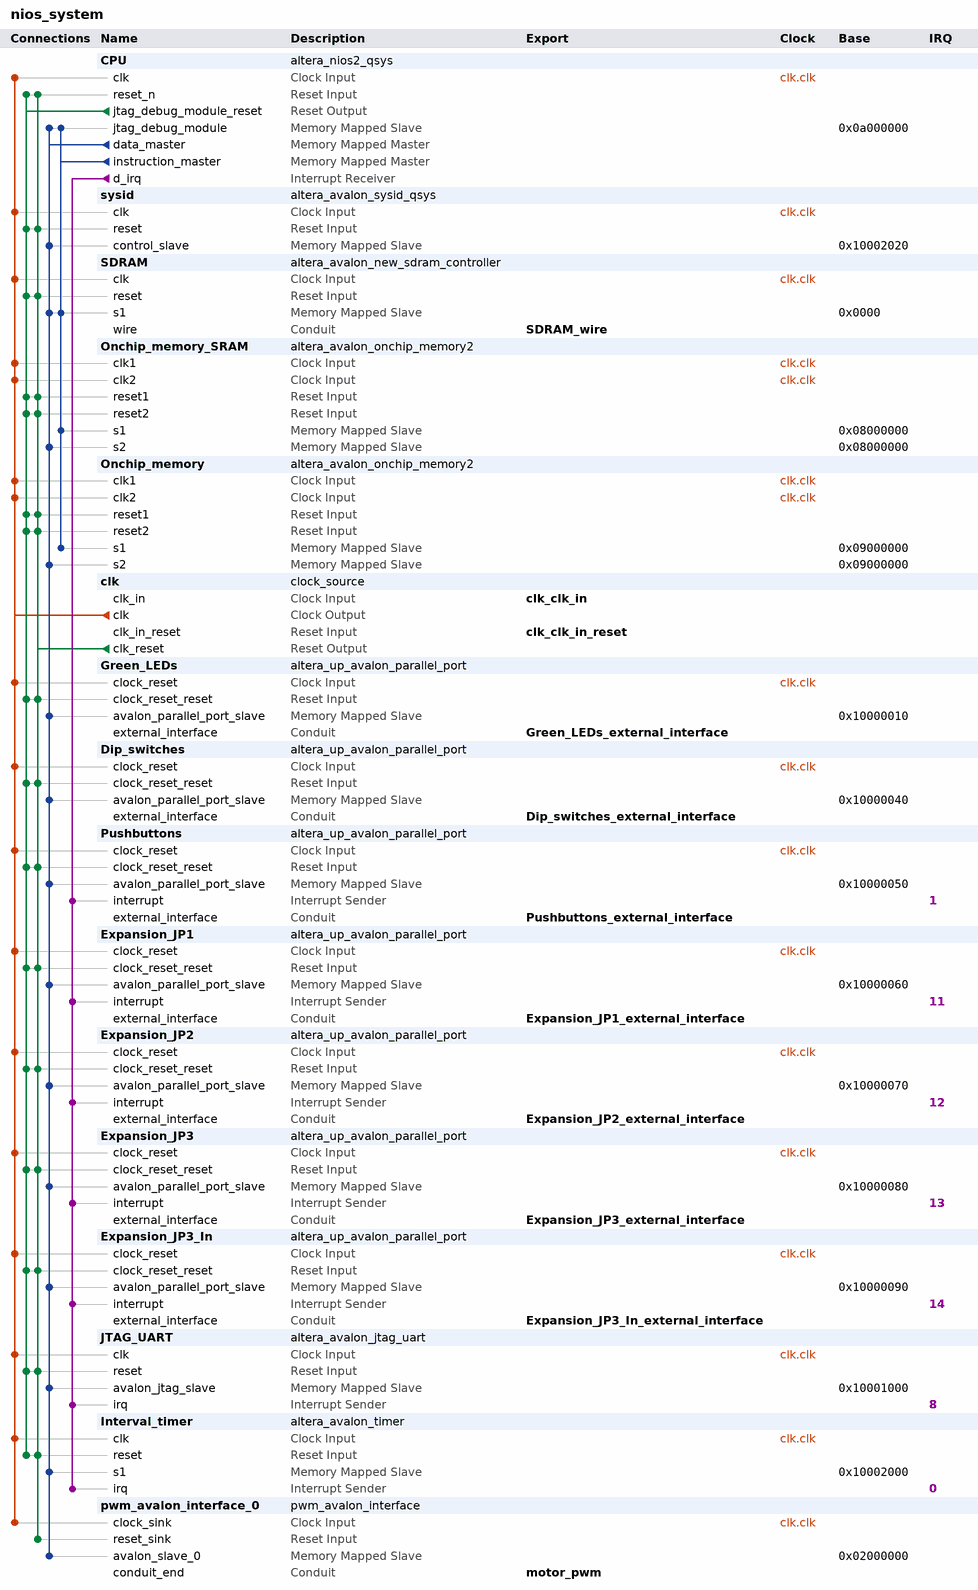
[diagram p0: system contents]
# Platform Designer (Qsys) system nios_system, Cyclone IV E EP4CE22F17C6
# Parameters at their usual value, and those the tool derives, are not listed.
package require -exact qsys 13.0
create_system nios_system
set_project_property DEVICE_FAMILY {Cyclone IV E}
set_project_property DEVICE EP4CE22F17C6

add_instance CPU altera_nios2_qsys 13.0
set_instance_parameter_value CPU manuallyAssignCpuID false
set_instance_parameter_value CPU resetSlave SDRAM.s1
set_instance_parameter_value CPU exceptionSlave SDRAM.s1
set_instance_parameter_value CPU breakSlave CPU.jtag_debug_module
set_instance_parameter_value CPU mmu_processIDNumBits 10
set_instance_parameter_value CPU impl Tiny
set_instance_parameter_value CPU icache_size 4096
set_instance_parameter_value CPU dcache_lineSize 4

add_instance sysid altera_avalon_sysid_qsys 13.0
set_instance_parameter_value sysid id 0

add_instance SDRAM altera_avalon_new_sdram_controller 13.0.1.99.2
set_instance_parameter_value SDRAM TAC 5.5
set_instance_parameter_value SDRAM TRCD 20.0
set_instance_parameter_value SDRAM TRP 20.0
set_instance_parameter_value SDRAM casLatency 3
set_instance_parameter_value SDRAM columnWidth 9
set_instance_parameter_value SDRAM dataWidth 16
set_instance_parameter_value SDRAM generateSimulationModel true
set_instance_parameter_value SDRAM model custom
set_instance_parameter_value SDRAM numberOfBanks 4
set_instance_parameter_value SDRAM numberOfChipSelects 1
set_instance_parameter_value SDRAM powerUpDelay 100.0
set_instance_parameter_value SDRAM refreshPeriod 15.625
set_instance_parameter_value SDRAM rowWidth 13

add_instance Onchip_memory_SRAM altera_avalon_onchip_memory2 13.0.1.99.2
set_instance_parameter_value Onchip_memory_SRAM dataWidth 32
set_instance_parameter_value Onchip_memory_SRAM dualPort true
set_instance_parameter_value Onchip_memory_SRAM initMemContent true
set_instance_parameter_value Onchip_memory_SRAM initializationFileName Onchip_memory_SRAM
set_instance_parameter_value Onchip_memory_SRAM memorySize 8192

add_instance Onchip_memory altera_avalon_onchip_memory2 13.0.1.99.2
set_instance_parameter_value Onchip_memory dataWidth 32
set_instance_parameter_value Onchip_memory dualPort true
set_instance_parameter_value Onchip_memory initMemContent true
set_instance_parameter_value Onchip_memory initializationFileName Onchip_memory
set_instance_parameter_value Onchip_memory memorySize 8192

add_instance clk clock_source 13.0
set_instance_parameter_value clk clockFrequency 50000000

add_instance Green_LEDs altera_up_avalon_parallel_port 13.0
set_instance_parameter_value Green_LEDs board DE0-Nano
set_instance_parameter_value Green_LEDs preset LEDs
set_instance_parameter_value Green_LEDs capture false
set_instance_parameter_value Green_LEDs edge Rising
set_instance_parameter_value Green_LEDs irq false

add_instance Dip_switches altera_up_avalon_parallel_port 13.0
set_instance_parameter_value Dip_switches board DE0-Nano
set_instance_parameter_value Dip_switches preset {Dip Switches}
set_instance_parameter_value Dip_switches capture false
set_instance_parameter_value Dip_switches edge Rising
set_instance_parameter_value Dip_switches irq false

add_instance Pushbuttons altera_up_avalon_parallel_port 13.0
set_instance_parameter_value Pushbuttons board DE0-Nano
set_instance_parameter_value Pushbuttons preset Pushbuttons
set_instance_parameter_value Pushbuttons capture true
set_instance_parameter_value Pushbuttons edge Falling
set_instance_parameter_value Pushbuttons irq true

add_instance Expansion_JP1 altera_up_avalon_parallel_port 13.0
set_instance_parameter_value Expansion_JP1 board DE0-Nano
set_instance_parameter_value Expansion_JP1 preset {Expansion Header}
set_instance_parameter_value Expansion_JP1 capture true
set_instance_parameter_value Expansion_JP1 edge Falling
set_instance_parameter_value Expansion_JP1 irq true

add_instance Expansion_JP2 altera_up_avalon_parallel_port 13.0
set_instance_parameter_value Expansion_JP2 board DE0-Nano
set_instance_parameter_value Expansion_JP2 preset {Expansion Header}
set_instance_parameter_value Expansion_JP2 gpio {GPIO 1 (JP2)}
set_instance_parameter_value Expansion_JP2 capture true
set_instance_parameter_value Expansion_JP2 edge Falling
set_instance_parameter_value Expansion_JP2 irq true

add_instance Expansion_JP3 altera_up_avalon_parallel_port 13.0
set_instance_parameter_value Expansion_JP3 board DE0-Nano
set_instance_parameter_value Expansion_JP3 preset {Expansion Header}
set_instance_parameter_value Expansion_JP3 gpio {GPIO 2 (JP3)}
set_instance_parameter_value Expansion_JP3 capture true
set_instance_parameter_value Expansion_JP3 edge Falling
set_instance_parameter_value Expansion_JP3 irq true

add_instance Expansion_JP3_In altera_up_avalon_parallel_port 13.0
set_instance_parameter_value Expansion_JP3_In board DE0-Nano
set_instance_parameter_value Expansion_JP3_In preset {Expansion Header}
set_instance_parameter_value Expansion_JP3_In gpio {GPIO 2 IN (JP3)}
set_instance_parameter_value Expansion_JP3_In capture true
set_instance_parameter_value Expansion_JP3_In edge Rising
set_instance_parameter_value Expansion_JP3_In irq true

add_instance JTAG_UART altera_avalon_jtag_uart 13.0.1.99.2
set_instance_parameter_value JTAG_UART simInteractiveOptions INTERACTIVE_ASCII_OUTPUT

add_instance Interval_timer altera_avalon_timer 13.0.1.99.2
set_instance_parameter_value Interval_timer period 125.0
set_instance_parameter_value Interval_timer periodUnits MSEC

add_instance pwm_avalon_interface_0 pwm_avalon_interface 1.0

# connections
add_connection clk.clk CPU.clk clock
add_connection clk.clk Dip_switches.clock_reset clock
add_connection clk.clk Expansion_JP1.clock_reset clock
add_connection clk.clk Expansion_JP2.clock_reset clock
add_connection clk.clk Expansion_JP3.clock_reset clock
add_connection clk.clk Expansion_JP3_In.clock_reset clock
add_connection clk.clk Green_LEDs.clock_reset clock
add_connection clk.clk Interval_timer.clk clock
add_connection clk.clk JTAG_UART.clk clock
add_connection clk.clk Onchip_memory.clk1 clock
add_connection clk.clk Onchip_memory.clk2 clock
add_connection clk.clk Onchip_memory_SRAM.clk1 clock
add_connection clk.clk Onchip_memory_SRAM.clk2 clock
add_connection clk.clk Pushbuttons.clock_reset clock
add_connection clk.clk pwm_avalon_interface_0.clock_sink clock
add_connection clk.clk SDRAM.clk clock
add_connection clk.clk sysid.clk clock
add_connection clk.clk_reset CPU.reset_n reset
add_connection clk.clk_reset Dip_switches.clock_reset_reset reset
add_connection clk.clk_reset Expansion_JP1.clock_reset_reset reset
add_connection clk.clk_reset Expansion_JP2.clock_reset_reset reset
add_connection clk.clk_reset Expansion_JP3.clock_reset_reset reset
add_connection clk.clk_reset Expansion_JP3_In.clock_reset_reset reset
add_connection clk.clk_reset Green_LEDs.clock_reset_reset reset
add_connection clk.clk_reset Interval_timer.reset reset
add_connection clk.clk_reset JTAG_UART.reset reset
add_connection clk.clk_reset Onchip_memory.reset1 reset
add_connection clk.clk_reset Onchip_memory.reset2 reset
add_connection clk.clk_reset Onchip_memory_SRAM.reset1 reset
add_connection clk.clk_reset Onchip_memory_SRAM.reset2 reset
add_connection clk.clk_reset Pushbuttons.clock_reset_reset reset
add_connection clk.clk_reset pwm_avalon_interface_0.reset_sink reset
add_connection clk.clk_reset SDRAM.reset reset
add_connection clk.clk_reset sysid.reset reset
add_connection CPU.jtag_debug_module_reset CPU.reset_n reset
add_connection CPU.jtag_debug_module_reset Dip_switches.clock_reset_reset reset
add_connection CPU.jtag_debug_module_reset Expansion_JP1.clock_reset_reset reset
add_connection CPU.jtag_debug_module_reset Expansion_JP2.clock_reset_reset reset
add_connection CPU.jtag_debug_module_reset Expansion_JP3.clock_reset_reset reset
add_connection CPU.jtag_debug_module_reset Expansion_JP3_In.clock_reset_reset reset
add_connection CPU.jtag_debug_module_reset Green_LEDs.clock_reset_reset reset
add_connection CPU.jtag_debug_module_reset Interval_timer.reset reset
add_connection CPU.jtag_debug_module_reset JTAG_UART.reset reset
add_connection CPU.jtag_debug_module_reset Onchip_memory.reset1 reset
add_connection CPU.jtag_debug_module_reset Onchip_memory.reset2 reset
add_connection CPU.jtag_debug_module_reset Onchip_memory_SRAM.reset1 reset
add_connection CPU.jtag_debug_module_reset Onchip_memory_SRAM.reset2 reset
add_connection CPU.jtag_debug_module_reset Pushbuttons.clock_reset_reset reset
add_connection CPU.jtag_debug_module_reset SDRAM.reset reset
add_connection CPU.jtag_debug_module_reset sysid.reset reset
add_connection CPU.data_master CPU.jtag_debug_module avalon
set_connection_parameter_value CPU.data_master/CPU.jtag_debug_module baseAddress 0x0a000000
add_connection CPU.data_master Dip_switches.avalon_parallel_port_slave avalon
set_connection_parameter_value CPU.data_master/Dip_switches.avalon_parallel_port_slave baseAddress 0x10000040
add_connection CPU.data_master Expansion_JP1.avalon_parallel_port_slave avalon
set_connection_parameter_value CPU.data_master/Expansion_JP1.avalon_parallel_port_slave baseAddress 0x10000060
add_connection CPU.data_master Expansion_JP2.avalon_parallel_port_slave avalon
set_connection_parameter_value CPU.data_master/Expansion_JP2.avalon_parallel_port_slave baseAddress 0x10000070
add_connection CPU.data_master Expansion_JP3.avalon_parallel_port_slave avalon
set_connection_parameter_value CPU.data_master/Expansion_JP3.avalon_parallel_port_slave baseAddress 0x10000080
add_connection CPU.data_master Expansion_JP3_In.avalon_parallel_port_slave avalon
set_connection_parameter_value CPU.data_master/Expansion_JP3_In.avalon_parallel_port_slave baseAddress 0x10000090
add_connection CPU.data_master Green_LEDs.avalon_parallel_port_slave avalon
set_connection_parameter_value CPU.data_master/Green_LEDs.avalon_parallel_port_slave baseAddress 0x10000010
add_connection CPU.data_master Interval_timer.s1 avalon
set_connection_parameter_value CPU.data_master/Interval_timer.s1 baseAddress 0x10002000
add_connection CPU.data_master JTAG_UART.avalon_jtag_slave avalon
set_connection_parameter_value CPU.data_master/JTAG_UART.avalon_jtag_slave baseAddress 0x10001000
add_connection CPU.data_master Onchip_memory.s2 avalon
set_connection_parameter_value CPU.data_master/Onchip_memory.s2 baseAddress 0x09000000
add_connection CPU.data_master Onchip_memory_SRAM.s2 avalon
set_connection_parameter_value CPU.data_master/Onchip_memory_SRAM.s2 baseAddress 0x08000000
add_connection CPU.data_master Pushbuttons.avalon_parallel_port_slave avalon
set_connection_parameter_value CPU.data_master/Pushbuttons.avalon_parallel_port_slave baseAddress 0x10000050
add_connection CPU.data_master pwm_avalon_interface_0.avalon_slave_0 avalon
set_connection_parameter_value CPU.data_master/pwm_avalon_interface_0.avalon_slave_0 baseAddress 0x02000000
add_connection CPU.data_master SDRAM.s1 avalon
set_connection_parameter_value CPU.data_master/SDRAM.s1 baseAddress 0x0000
add_connection CPU.data_master sysid.control_slave avalon
set_connection_parameter_value CPU.data_master/sysid.control_slave baseAddress 0x10002020
add_connection CPU.instruction_master CPU.jtag_debug_module avalon
set_connection_parameter_value CPU.instruction_master/CPU.jtag_debug_module baseAddress 0x0a000000
add_connection CPU.instruction_master Onchip_memory.s1 avalon
set_connection_parameter_value CPU.instruction_master/Onchip_memory.s1 baseAddress 0x09000000
add_connection CPU.instruction_master Onchip_memory_SRAM.s1 avalon
set_connection_parameter_value CPU.instruction_master/Onchip_memory_SRAM.s1 baseAddress 0x08000000
add_connection CPU.instruction_master SDRAM.s1 avalon
set_connection_parameter_value CPU.instruction_master/SDRAM.s1 baseAddress 0x0000
add_connection CPU.d_irq Expansion_JP1.interrupt interrupt
set_connection_parameter_value CPU.d_irq/Expansion_JP1.interrupt irqNumber 11
add_connection CPU.d_irq Expansion_JP2.interrupt interrupt
set_connection_parameter_value CPU.d_irq/Expansion_JP2.interrupt irqNumber 12
add_connection CPU.d_irq Expansion_JP3.interrupt interrupt
set_connection_parameter_value CPU.d_irq/Expansion_JP3.interrupt irqNumber 13
add_connection CPU.d_irq Expansion_JP3_In.interrupt interrupt
set_connection_parameter_value CPU.d_irq/Expansion_JP3_In.interrupt irqNumber 14
add_connection CPU.d_irq Interval_timer.irq interrupt
set_connection_parameter_value CPU.d_irq/Interval_timer.irq irqNumber 0
add_connection CPU.d_irq JTAG_UART.irq interrupt
set_connection_parameter_value CPU.d_irq/JTAG_UART.irq irqNumber 8
add_connection CPU.d_irq Pushbuttons.interrupt interrupt
set_connection_parameter_value CPU.d_irq/Pushbuttons.interrupt irqNumber 1

# exported interfaces
add_interface SDRAM_wire conduit end
set_interface_property SDRAM_wire EXPORT_OF SDRAM.wire
add_interface Dip_switches_external_interface conduit end
set_interface_property Dip_switches_external_interface EXPORT_OF Dip_switches.external_interface
add_interface clk_clk_in_reset reset sink
set_interface_property clk_clk_in_reset EXPORT_OF clk.clk_in_reset
add_interface Expansion_JP1_external_interface conduit end
set_interface_property Expansion_JP1_external_interface EXPORT_OF Expansion_JP1.external_interface
add_interface Green_LEDs_external_interface conduit end
set_interface_property Green_LEDs_external_interface EXPORT_OF Green_LEDs.external_interface
add_interface Expansion_JP3_external_interface conduit end
set_interface_property Expansion_JP3_external_interface EXPORT_OF Expansion_JP3.external_interface
add_interface Expansion_JP2_external_interface conduit end
set_interface_property Expansion_JP2_external_interface EXPORT_OF Expansion_JP2.external_interface
add_interface clk_clk_in clock sink
set_interface_property clk_clk_in EXPORT_OF clk.clk_in
add_interface Pushbuttons_external_interface conduit end
set_interface_property Pushbuttons_external_interface EXPORT_OF Pushbuttons.external_interface
add_interface Expansion_JP3_In_external_interface conduit end
set_interface_property Expansion_JP3_In_external_interface EXPORT_OF Expansion_JP3_In.external_interface
add_interface motor_pwm conduit end
set_interface_property motor_pwm EXPORT_OF pwm_avalon_interface_0.conduit_end

set_interconnect_requirement {$system} qsys_mm.clockCrossingAdapter HANDSHAKE
set_interconnect_requirement {$system} qsys_mm.maxAdditionalLatency 0

save_system nios_system.qsys
